# Altium schematic sheet CarGeoLogger.SchDoc
size C; SheetNumber: 1; SheetTotal: 1
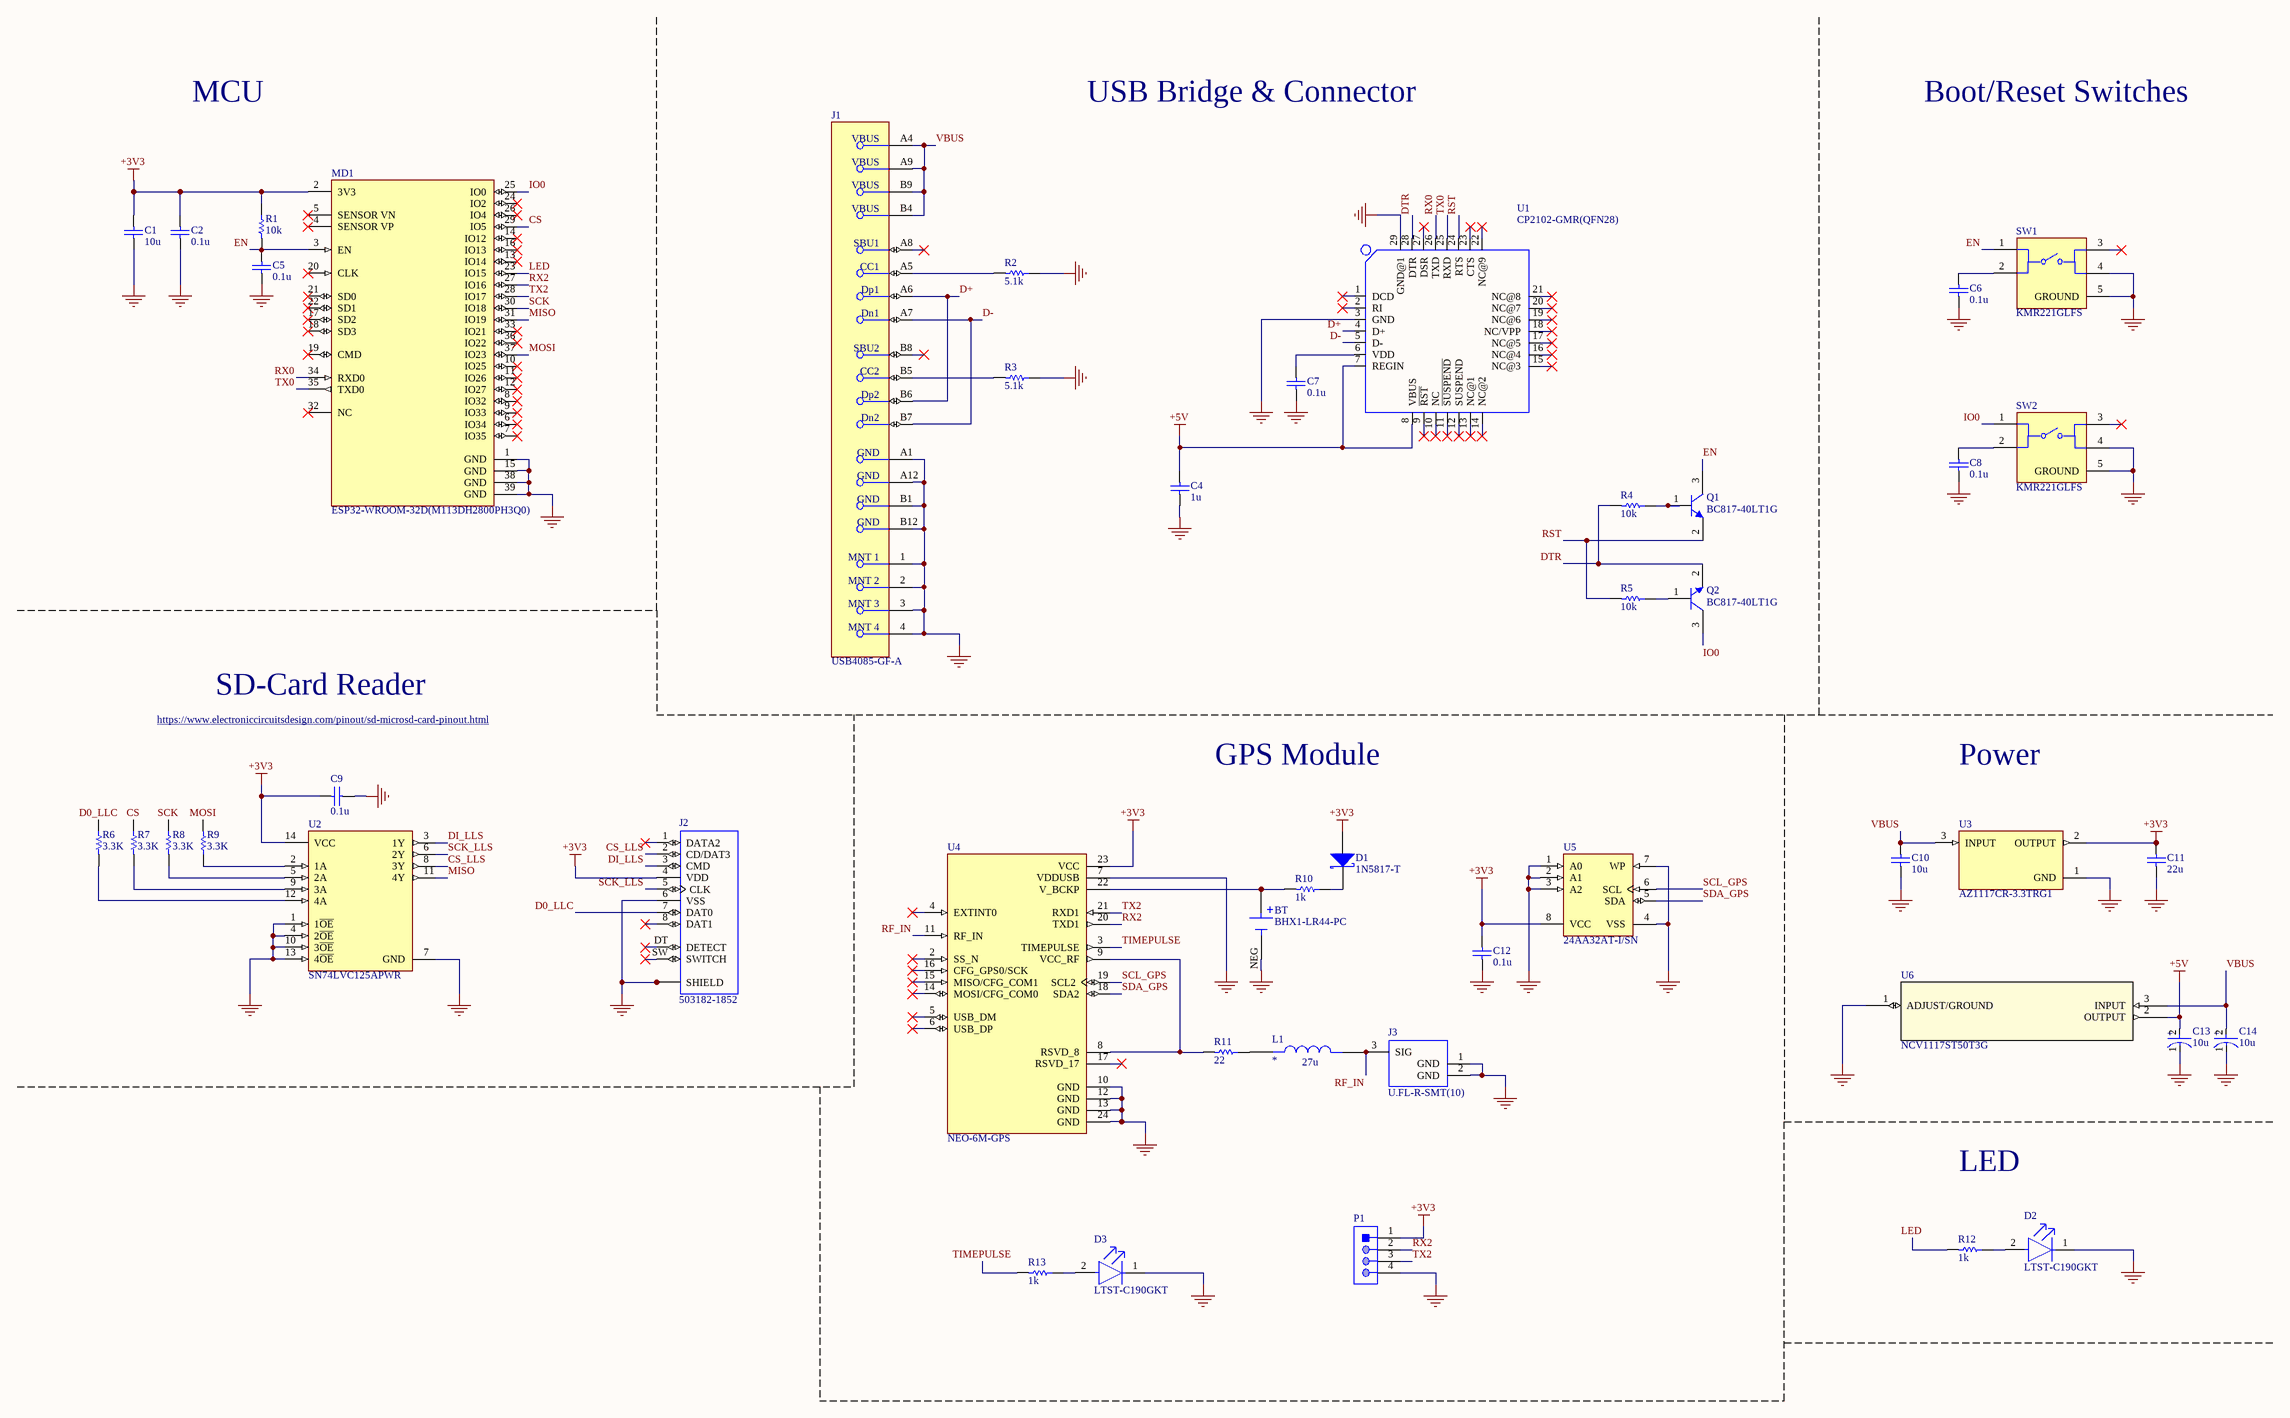
[diagram p0: CarGeoLogger.SchDoc]

## Parts
BT  BHX1-LR44-PC  [BAT_BHX1-LR44-PC]
C1  10u  [CAPC1608X90X35ML10T15]
C2  0.1u  [CAPC1608X90X35ML10T15]
C4  1u  [CAPC1608X90X35ML10T15]
C5  0.1u  [CAPC1608X90X35ML10T15]
C6  0.1u  [CAPC1608X90X35ML10T15]
C7  0.1u  [CAPC1608X90X35ML10T15]
C8  0.1u  [CAPC1608X90X35ML10T15]
C9  0.1u  [CAPC1608X90X35ML10T15]
C10  10u  [CAPC1608X90X35ML10T15]
C11  22u  [CAPC1608X90X35ML10T15]
C12  0.1u  [CAPC1608X90X35ML10T15]
C13  10u  [FP-F38M-MFG]
C14  10u  [FP-F38M-MFG]
D1  1N5817-T  [DIOD-DO-41-P-2]
D2  LTST-C190GKT  [FP-LTST-C190GKT-MFG]
D3  LTST-C190GKT  [FP-LTST-C190GKT-MFG]
J1  USB4085-GF-A  [FP-USB4085-GF-A-MFG]
J2  503182-1852  [MOLEX_503182-1852]
J3  U.FL-R-SMT(10)  [HRS-U.FL-R-SMT_V]
L1  27u  [INDC1608X95N]
MD1  ESP32-WROOM-32D(M113DH2800PH3Q0)  [FP-ESP32-WROOM-32D_M113DH-MFG]
P1  (no value)  [61300411121]
Q1  BC817-40LT1G  [ONSC-SOT-23-3-318-08_V]
Q2  BC817-40LT1G  [ONSC-SOT-23-3-318-08_V]
R1  10k  [RESC1609X50X30NL8T20]
R2  5.1k  [RESC1609X50X30NL8T20]
R3  5.1k  [RESC1609X50X30NL8T20]
R4  10k  [RESC1609X50X30NL8T20]
R5  10k  [RESC1609X50X30NL8T20]
R6  3.3K  [RESC1609X50X30NL8T20]
R7  3.3K  [RESC1609X50X30NL8T20]
R8  3.3K  [RESC1609X50X30NL8T20]
R9  3.3K  [RESC1609X50X30NL8T20]
R10  1k  [RESC1609X50X30NL8T20]
R11  22  [RESC1609X50X30NL8T20]
R12  1k  [RESC1609X50X30NL8T20]
R13  1k  [RESC1609X50X30NL8T20]
SW1  KMR221GLFS  [FP-KMR221GLFS-MFG]
SW2  KMR221GLFS  [FP-KMR221GLFS-MFG]
U1  CP2102-GMR(QFN28)  [QFN28G_0.5-5X5MM]
U2  SN74LVC125APWR  [FP-PW0014A-IPC_B]
U3  AZ1117CR-3.3TRG1  [FP-SOT89-MFG]
U4  NEO-6M-GPS  [XCVR_NEO-6M-GPS]
U5  24AA32AT-I/SN  [SOIC-SN8_L]
U6  NCV1117ST50T3G  [SOT223-3_ONS]

## Nets
+3V3: C1.2 C2.2 C9.2 C11.2 C12.2 D1.1(A) J2.4(VDD) MD1.2(3V3) P1.1 R1.1 U2.14(VCC) U3.2(OUTPUT) U4.23(VCC) U5.8(VCC)
+5V: C4.2 C13.2(A) U1.7(REGIN) U1.8(VBUS) U6.2(OUTPUT)
NetBT_NEG: BT.NEG C1.1 C2.1 C4.1 C5.1 C6.1 C7.1 C8.1 C9.1 C10.1 C11.1 C12.1 C13.1(C) C14.1(C) D2.1(C) D3.1(C) J1.1(MNT_1) J1.2(MNT_2) J1.3(MNT_3) J1.4(MNT_4) J1.A1(GND) J1.A12(GND) J1.B1(GND) J1.B12(GND) J2.6(VSS) J2.P1(SHIELD) J2.P2(SHIELD) J2.P3(SHIELD) J2.P4(SHIELD) J2.P5(SHIELD) J3.1(GND) J3.2(GND) MD1.1(GND) MD1.15(GND) MD1.38(GND) MD1.39(GND) P1.4 R2.1 R3.1 SW1.4 SW1.5(GROUND) SW2.4 SW2.5(GROUND) U1.3(GND) U1.29(GND@1) U2.1(1~{OE}) U2.4(2~{OE}) U2.7(GND) U2.10(3~{OE}) U2.13(4~{OE}) U3.1(GND) U4.7(VDDUSB) U4.10(GND) U4.12(GND) U4.13(GND) U4.24(GND) U5.1(A0) U5.2(A1) U5.3(A2) U5.4(VSS) U5.7(WP) U6.1(ADJUST/GROUND)
CS: MD1.29(IO5) R7.1
CS_LLS: J2.2(CD/DAT3) U2.8(3Y)
D0_LLC: J2.7(DAT0) R6.1
D+: J1.A6(Dp1) J1.B6(Dp2) U1.4(D+)
D-: J1.A7(Dn1) J1.B7(Dn2) U1.5(D-)
DI_LLS: J2.3(CMD) U2.3(1Y)
DTR: Q2.2(E) R4.2 U1.28(DTR)
EN: C5.2 MD1.3(EN) Q1.3(C) R1.2 SW1.1
IO0: MD1.25(IO0) Q2.3(C) SW2.1
LED: MD1.23(IO15) R12.2
MISO: MD1.31(IO19) U2.11(4Y)
MOSI: MD1.37(IO23) R9.2
RF_IN: J3.3(SIG) L1.2 U4.11(RF_IN)
RST: Q1.2(E) R5.2 U1.24(RTS)
RX0: MD1.34(RXD0) U1.26(TXD)
RX2: MD1.27(IO16) P1.2 U4.20(TXD1)
SCK: MD1.30(IO18) R8.1
SCK_LLS: J2.5(CLK) U2.6(2Y)
SCL_GPS: U4.19(SCL2) U5.6(SCL)
SDA_GPS: U4.18(SDA2) U5.5(SDA)
TIMEPULSE: R13.2 U4.3(TIMEPULSE)
TX0: MD1.35(TXD0) U1.25(RXD)
TX2: MD1.28(IO17) P1.3 U4.21(RXD1)
VBUS: C10.2 C14.2(A) J1.A4(VBUS) J1.A9(VBUS) J1.B4(VBUS) J1.B9(VBUS) U3.3(INPUT) U6.3(INPUT)
NetBT_1+: BT.1+(POS) BT.2+(POS) R10.2 U4.22(V_BCKP)
NetC6_2: C6.2 SW1.2
NetC7_2: C7.2 U1.6(VDD)
NetC8_2: C8.2 SW2.2
NetD1_2: D1.2(K) R10.1
NetD2_2: D2.2(A) R12.1
NetD3_2: D3.2(A) R13.1
NetJ1_A5: J1.A5(CC1) R2.2
NetJ1_B5: J1.B5(CC2) R3.2
NetL1_1: L1.1 R11.1
NetQ1_1: Q1.1(B) R4.1
NetQ2_1: Q2.1(B) R5.1
NetR6_2: R6.2 U2.12(4A)
NetR7_2: R7.2 U2.9(3A)
NetR8_2: R8.2 U2.5(2A)
NetR9_1: R9.1 U2.2(1A)
NetR11_2: R11.2 U4.8(RSVD_8) U4.9(VCC_RF)

Not connected (* = marked no-connect by the designer): J1 A8(SBU1)* B8(SBU2)*; J2 1(DATA2)* 8(DAT1)* DT(DETECT)* SW(SWITCH)*; MD1 4(SENSOR_VP)* 5(SENSOR_VN)* 6(IO34)* 7(IO35)* 8(IO32)* 9(IO33)* 10(IO25)* 11(IO26)* 12(IO27)* 13(IO14)* 14(IO12)* 16(IO13)* 17(SD2)* 18(SD3)* 19(CMD)* 20(CLK)* 21(SD0)* 22(SD1)* 24(IO2)* 26(IO4)* 32(NC)* 33(IO21)* 36(IO22)*; SW1 3*; SW2 3*; U1 1(DCD)* 2(RI)* 9(~{RST})* 10(NC)* 11(~{SUSPEND})* 12(SUSPEND)* 13(NC@1)* 14(NC@2)* 15(NC@3)* 16(NC@4)* 17(NC@5)* 18(NC/VPP)* 19(NC@6)* 20(NC@7)* 21(NC@8)* 22(NC@9)* 23(CTS)* 27(DSR)*; U4 2(SS_N)* 4(EXTINT0)* 5(USB_DM)* 6(USB_DP)* 14(MOSI/CFG_COM0)* 15(MISO/CFG_COM1)* 16(CFG_GPS0/SCK)* 17(RSVD_17)*

## Notes on the sheet
- MCU
- USB Bridge & Connector
- Boot/Reset Switches
- SD-Card Reader
- https://www.electroniccircuitsdesign.com/pinout/sd-microsd-card-pinout.html
- GPS Module
- Power
- LED
- (in symbol CMP-04423-000015-1) +

## Library data of the parts
BT = CMP-047-000000-1: Battery Retainer Coin, 12.0mm 1 Cell PC Pin; MF: MPD; Pin Count: 3; Source: SnapEDAsch.SchLib; Value: *; Component Type: Standard; Design Item ID: BHX1-LR44-PC; SnapEDA_Link: https://www.snapeda.com/parts/BHX1-LR44-PC/MPD/view-part/4480525/?ref=snap; Package: None; Price: None; Availability: Unavailable; MP: BHX1-LR44-PC; ComponentLink1Description: https://www.digikey.com/en/products/detail/mpd-memory-protection-devices/BHX1-LR44-PC/2194773; ComponentLink1URL: *
C1 C2 C4-C10 C12 = CMP-2000-04945-1: Chip Capacitor, 0603 (1608 Metric); Manufacturer: Murata; Capacitance: 22pF; Tolerance (%): ±5%; Rated Voltage: 50V; Dielectric: C0G; Manufacturer URL: http://www.murata.com/; Datasheet Version: Jul-06; Package Reference: 603; Case Size/Dimension: 0603; Package Description: 2-Pin Surface Mount Device, Body 1.6 x 0.8 mm; Datasheet URL: https://datasheet.ciiva.com/11786/0900766b807a1cab-11786398.pdf
C11 = CMP-2000-04945-1: Chip Capacitor, 0603 (1608 Metric), F381A106MMAAH1; Manufacturer: Murata; Capacitance: 22pF; Tolerance (%): ±5%; Rated Voltage: 50V; Dielectric: C0G; Manufacturer URL: http://www.murata.com/; Datasheet Version: Jul-06; Package Reference: 603; Case Size/Dimension: 0603; Package Description: 2-Pin Surface Mount Device, Body 1.6 x 0.8 mm; Datasheet URL: https://datasheet.ciiva.com/11786/0900766b807a1cab-11786398.pdf; ComponentLink1Description: https://www.digikey.com/en/products/detail/kyocera-avx/F381A106MMAAH1/5730801; ComponentLink1URL: *
C13 C14 = CMP-04423-000015-1: CAP TANT POLY 10UF 10V SMD; Manufacturer Part Number: F381A106MMAAH1; Manufacturer: AVX; Material: Tantalum-Polymer; Life: 1000Hours; Ripple Current: 289mA; Leakage Current: 10uA; Dissipation Factor: 15%; Esr: 300mΩ; Tolerance: 20%; Category: Cap; ComponentLink2URL: http://datasheets.avx.com/F38.pdf; Automotive: No; Package: F38M; Device Class L2: Capacitors; Octopart: https://octopart.com/f381a106mmaah1-avx-67040376; Device Class L1: Passive Components; Lead Free: Yes; Temperature Range High: +105°C; ComponentLink2Description: Datasheet; Digikey Description: CAP TANT POLY 10UF 10V SMD; Value: 10uF; Temperature Range Low: -55°C; Temperature: -55°C to +105°C; Device Class L3: Polymer Capacitors; Capacitance: 10uF; Height: 0.9mm; Footprint Url: http://www.avx.com/download/software/literature/AVX-Footprint-Library.pdf; RoHS: TRUE; Voltage Rating: 10V; Mouser Description: Cap Tant Polymer 10uF 10VDC M CASE 20% (1.6 X 0.85 X 0.8mm) Undertab SMD 1608-09 0.3 Ohm 105C T/R
D1 = CMP-2000-05521-1: Schottky Barrier Rectifier, 1 A, 20 V, -65 to 125 degC, 2-Pin DO-41, RoHS, Tape and Reel; Manufacturer: DiodesIncorporated; Vrrm - Repetitive Reverse Voltage: 20V; If - Forward Current: 1A; Configuration: Single; Unit Weight: 0.010582oz; Type: SchottkyDiode; Ifsm - Forward Surge Current: 25A; Vf - Forward Voltage: 0.75Vat3A; Ir - Reverse Current: 1000uA; Technology: Si; Length: 5.21mm; Product: SchottkyRectifiers; Package Reference: DO-41-P-2; Package / Case: DO-41; Datasheet URL: http://www.diodes.com/_files/datasheets/ds23001.pdf; Operating Temperature Range: -65Cto+125C; Mounting Style: ThroughHole; Manufacturer URL: http://www.diodes.com/; Series: 1N58; Minimum Operating Temperature: -65C; Height: 2.72mm; Brand: DiodesIncorporated; Maximum Operating Temperature: +125C; Datasheet Version: Rev. 8-2, 05/2009; Factory Pack Quantity: 5000; Width: 2.72mm; RoHS: True; Product Category: SchottkyDiodes&Rectifiers; Package Description: 2-Pin Through Hole Device, Body 4.635 x 2.36 mm, Pin Spacing 7.85 mm; Packaging: Reel; Termination Style: ThroughHole; Mounting Technology: ThroughHole
D2 D3 = CMP-22017-000005-2: LED GREEN CLEAR CHIP SMD; Dominant Wavelength: 569nm; Reverse Voltage: 5V; Lens Color: Colorless; Viewing Angle: 130°; Voltage: 2V; Forward Current: 30mA; Power Dissipation: 100mW; Luminous Intensity: 6mcd; Number of LEDs: 1; Forward Voltage: 2.1V; Wavelength: 565nm; Test Current: 10mA; Min Operating Temperature: -55°C; Lens Style: Clear; Mount: Surface Mount; Width: 0.8mm; Packaging: Tape and Reel; Lens Transparency: Clear; Case Code (Metric): 1608; Depth: 0.8mm; Case Code (Imperial): 0603; Case/Package: 0603; Number of Pins: 2; Max Operating Temperature: 85°C; Lead Free: Lead Free; Number of Elements: 1; Length: 1.6mm; Height: 0.8mm; Package Quantity: 1; Power Rating: 100mW; Radiation Hardening: No; Illumination Color: Green; Color: Green
J1 = CMP-196119-000001-2: CONN RCPT USB2.0 TYPE C 24POS RA; Gender: Receptacle; Number of Positions: 16; USB Standard: USB 2.0; Orientation: Right Angle; Contact Plating: Gold; Contact Material: Copper Alloy; ComponentLink1Description: https://www.digikey.com/en/products/detail/gct/USB4085-GF-A/9859662; ComponentLink1URL: *
J2 = CMP-041-000000-1: Conn Micro SD Card M 8 POS 1.09mm Solder RA SMD Embossed T/R 0.5A/Contact; Package: None; Price: None; Design Item ID: 503182-1852; Value: *; Availability: Unavailable; Source: 503182-1852.SchLib; Component Type: Standard; Pin Count: 15; MP: 503182-1852; ComponentLink1Description: https://www.digikey.com/en/products/detail/molex/5031821852/4693482?utm_source=snapeda&utm_medium=aggregator&utm_campaign=buynow; ComponentLink1URL: *
J3 = CMP-002-00035-2: Ultra Small Surface Mount Coaxial Connector, 50 Ohm, -40 to 90 degC, 3-Pin SMD, RoHS, Tape and Reel; Manufacturer: Hirose Electric; Impedance: 50Ohm; Connector Type: RF&Coax; RoHS Compliant: True; Datasheet Version: Aug-16; Contact Material: Brass; Packaging: TapeandReel; Mounting Technology: SM; Package Description: 3-Pin Surface Mount Device, Body 2.6 x 2.6 mm; Max Operating Temperature: 90°C; Datasheet URL: https://www.hirose.com/product/en/download_file/key_name/U.FL/category/Catalog/doc_file_id/31697/?file_category_id=4&item_id=15&is_series=1; Package Reference: U.FL-R-SMT; Contact Plating: Gold; Min Operating Temperature: -40°C; Fastening Type: Snap; Package Quantity: 2500; Resistance: 50Ohm; Manufacturer URL: https://www.hirose.com; Case/Package: U.FL-R-SMT; ComponentLink1Description: https://www.digikey.com/en/products/detail/hirose-electric-co-ltd/U-FL-R-SMT-1-10/2391570; ComponentLink1URL: *
L1 = CMP-049-000000-1: Ind RF Chip Shielded Multi-Layer 27uH 10% 1MHz 20Q-Factor Ferrite 2mA 0603 Punched Paper T/R; MF: TDK; Value: *; Check_prices: https://www.snapeda.com/parts/MLF1608C270KTD00/TDK-Lambda+Americas+Inc/view-part/?ref=eda; Source: MLF1608C270KTD00.SchLib; Package: 1608 Taiyo Yuden; SnapEDA_Link: https://www.snapeda.com/parts/MLF1608C270KTD00/TDK-Lambda+Americas+Inc/view-part/?ref=snap; Design Item ID: MLF1608C270KTD00; Pin Count: 2; Component Type: Standard; Purchase-URL: https://pricing.snapeda.com/search/part/MLF1608C270KTD00/?ref=eda; MP: MLF1608C270KTD00
MD1 = CMP-194065-000024-1: RX TXRX MOD WIFI TRACE ANT SMD
P1 = CMP-1502-01064-1: THT Vertical Pin Header WR-PHD, Pitch 2.54 mm, Single Row, 4 pins; Manufacturer: Wurth Elektronik; Withstanding Voltage: 500VAC; Rated Current: 3A; Working Voltage: 250VAC; Pin Number: 4; Gender: Male; Contact Resistance: 20mOhm; Pitch: 2.54mm; Manufacturer URL: http://www.we-online.de; Operating Temperature: -40to105degC; Packaging: Bag; Mounting Technology: THT; Package Reference: 61300411121; Datasheet URL: https://katalog.we-online.de/em/datasheet/6130xx11121.pdf; Publisher: WurthElektronik; Part Number: 61300411121; Row Number: Single; Orientation: Vertical
Q1 Q2 = CMP-1048-00019-1: General Purpose Transistor, NPN Silicon, 3-Pin SOT-23, Pb-Free, Tape and Reel; Manufacturer: On Semiconductor; fT Min (MHz): 100; IC Continuous (A): 0.5; ComponentLink2URL: http://www.onsemi.com/pub_link/Collateral/BC817-16LT1-D.PDF; DatasheetVersion: Rev. 12; ComponentLink3URL: http://www.onsemi.cn/pub_link/Collateral/318-08.PDF; ComponentLink3Description: Package Specification; ComponentLink1Description: Manufacturer URL; Mounting Technology: Surface Mount; ComponentLink1URL: http://www.onsemi.com/; Packing: Tape and Reel; ComponentLink2Description: Datasheet; Polarity: NPN; RoHS: TRUE; PackageVersion: Rev. AP, 11/2009; PartNumber: BC817-40LT1G; PackageDescription: 3-Pin Small Outline Transistor, Body 2.92 x 1.3 mm, Pitch 0.95 mm; PackageReference: SOT-23-3-318-08
R1-R13 = CMP-2000-03816-5: Chip Resistor, 0603 (1608 Metric); Manufacturer: Vishay Semiconductor; Voltage Rating: 75 V; Package Quantity: 5000; DatasheetVersion: 06/2012; Min Operating Temperature: -55 degC; ComponentLink1URL: http://www.vishay.com/; Mounting Technology: Surface Mount; Height: 0.45 mm; ComponentLink1Description: Manufacturer URL; REACH SVHC: Unknown; PackageReference: 0603; Packaging: Tape and Reel; Max Operating Temperature: 155 degC; Mount: Surface Mount; ComponentLink2Description: Datasheet; PackageDescription: 2-Pin Surface Mount Device, Body 1.575 x 0.85 mm; Length: 1.55 mm; ComponentLink2URL: http://www.vishay.com/docs/20035/dcrcwe3.pdf; Pins: 2; RoHSCompliant: true
SW1 SW2 = CMP-10040-000018-1: SWITCH TACTILE SPST-NO 0.05A 32V; Illumination Type: Non-Illuminated; Contact Resistance: 100mR; Power Rating: 1W; Actuator Type: Standard; Operating Force: 2N; Max Current Rating: 50mA; Switch Function: Off-Mom; Switch Travel: 0.25mm; Actuator Length: 0.5mm; Mechanical Life: 200000Cycles; Throw Configuration: SPST; Length: 2.8mm; Max Voltage Rating (DC): 32V; Depth: 4.6mm; Orientation: Straight; Max Operating Temperature: 85°C; Packaging: Tape and Reel; Voltage Rating (DC): 32V; Width: 2.8mm; Termination: Gull Wing; Contact Plating: Silver; Case/Package: SMD/SMT; Contact Current Rating: 50mA; Mount: Surface Mount; Current Rating: 50mA; REACH SVHC: No SVHC; Lead Free: Lead Free; Radiation Hardening: No; Package Quantity: 1; Contact Material: Silver; Min Operating Temperature: -40°C
U1 = CMP-037-000000-1: USB Bridge, USB to UART USB 2.0 UART Interface 28-QFN _5x5_; MF: Silicon; MP: CP2102-GMR; Price: None; Component Type: Standard; Design Item ID: INTERFACE-CP2102-GMR(QFN28); Value: *; Availability: Unavailable; Package: VFQFN-28 Vishay Siliconix; Pin Count: 29; SnapEDA_Link: https://www.snapeda.com/parts/CP2102-GMR/Silicon%20Labs/view-part/570818/?ref=snap; Source: SnapEDAsch.SchLib; ComponentLink1Description: https://www.digikey.com/en/products/detail/silicon-labs/CP2102-GMR/2051863; ComponentLink1URL: *
U2 = CMP-0440-00179-4: IC BUF NON-INVERT 3.6V 14TSSOP; Max Power Dissipation: 500mW; Number of Bits per Element: 1; Number of Bits: 4; Quiescent Current: 1uA; Min Supply Voltage: 1.65V; Propagation Delay: 4.6ns; High Level Output Current: -24mA; Logic Function: Buffer; Low Level Output Current: 24mA; Polarity: Non-Inverting; Turn-On Delay Time: 5.3ns; Number of Output Lines: 3; Mount: Surface Mount; Lead Free: Lead Free; Number of Outputs: 4; Max Supply Voltage: 3.6V; Packaging: Tape and Reel; Radiation Hardening: No; Number of Channels: 4; REACH SVHC: No SVHC; Length: 5mm; Number of Elements: 4; Contact Plating: Gold; Case/Package: TSSOP; Number of Input Lines: 4; Number of Inputs: 4; Height: 1.15mm; Number of Circuits: 4; Termination: SMD/SMT; Min Operating Temperature: -40°C; Package Quantity: 1; Number of Gates: 4; Max Operating Temperature: 125°C; Width: 4.4mm; Number of Pins: 14
U3 = CMP-12756-000007-1: IC REG LINEAR 3.3V 800MA SOT89; Manufacturer: Diodes Inc.; Nominal Supply Current: 4mA; Output Type: Fixed; Accuracy Percentage: 1%; Max Junction Temp: +125°C; Max Supply Voltage: 15V; Number Of Outputs: 1; Output Current: 1.35A; Dropout Voltage: 1.2V; Device Class L1: Integrated Circuits (ICs); ComponentLink2URL: https://www.diodes.com/assets/Datasheets/AZ1117C.pdf; Temperature Range High: +125°C; Octopart: https://octopart.com/az1117cr-3.3trg1-diodes+inc.-30954805; Output Voltage: 3.3V; Automotive: No; RoHS: TRUE; Temperature Range Low: -20°C; Package: SOT89; Height: 1.6mm; Mouser Description: DiodesZetex AZ1117CR-3.3TRG1, LDO Regulator, 800mA, 3.3 V, ±1% 3-Pin, SOT-89; Manufacturer Part Number: AZ1117CR-3.3TRG1; ComponentLink2Description: Datasheet; Device Class L2: Power Management ICs; Lead Free: Yes; Device Class L3: Voltage Regulators - Linear; Category: IC; Temperature: -20°C to +125°C; Footprint Url: https://www.diodes.com/assets/Package-Files/SOT89.pdf; Digikey Description: IC REG LINEAR 3.3V 800MA SOT89
U4 = CMP-045-000000-1: SMD GPS Module; Pin Count: 23; Package: None; Component Type: Standard; Value: *; Design Item ID: NEO-6M-GPS; Price: None; MP: NEO-6M-GPS; Source: NEO-6M-GPS.SchLib; Availability: Unavailable
U5 = CMP-0159-00211-1: 32Kbit, 400kHz, 1.7V, I2C Serial EEPROM, 8-Pin SOIC 150mil, Industrial Temperature, Tape and Reel; PackageDescription: 8-Lead Plastic Small Outline (SN) - Narrow, 3.90mm Body [SOIC]; Code_JEDEC: MS-012; Code_IPC: SOIC127P600-8; PackageVersion: revBB, Aug-2009; PackageReference: SOIC-SN8; DatasheetVersion: revJ, Feb-2009
U6 = CMP-053-000001-1: No Description Available; Mfr_Name: onsemi; Type: DEV; Manufacturer_Part_Number: NCV1117ST50T3G; Source: NCV1117ST50T3G.SchLib; Copyright: Copyright (C) 2022 Ultra Librarian. All rights reserved.; Digi-Key_Part_Number_4: 2156-NCV1117ST50T3G-OS-ND; Digi-Key_Part_Number_3: NCV1117ST50T3GOSTR-ND; Design Item ID: NCV1117ST50T3G; Digi-Key_Part_Number_2: NCV1117ST50T3GOSDKR-ND; Digi-Key_Part_Number_1: NCV1117ST50T3GOSCT-ND; RefDes: RefDes; ComponentLink1Description: https://www.digikey.com/en/products/detail/onsemi/NCV1117ST50T3G/1792666; ComponentLink1URL: *